# Altium schematic sheet DISPLAYPORT.SchDoc
size A3
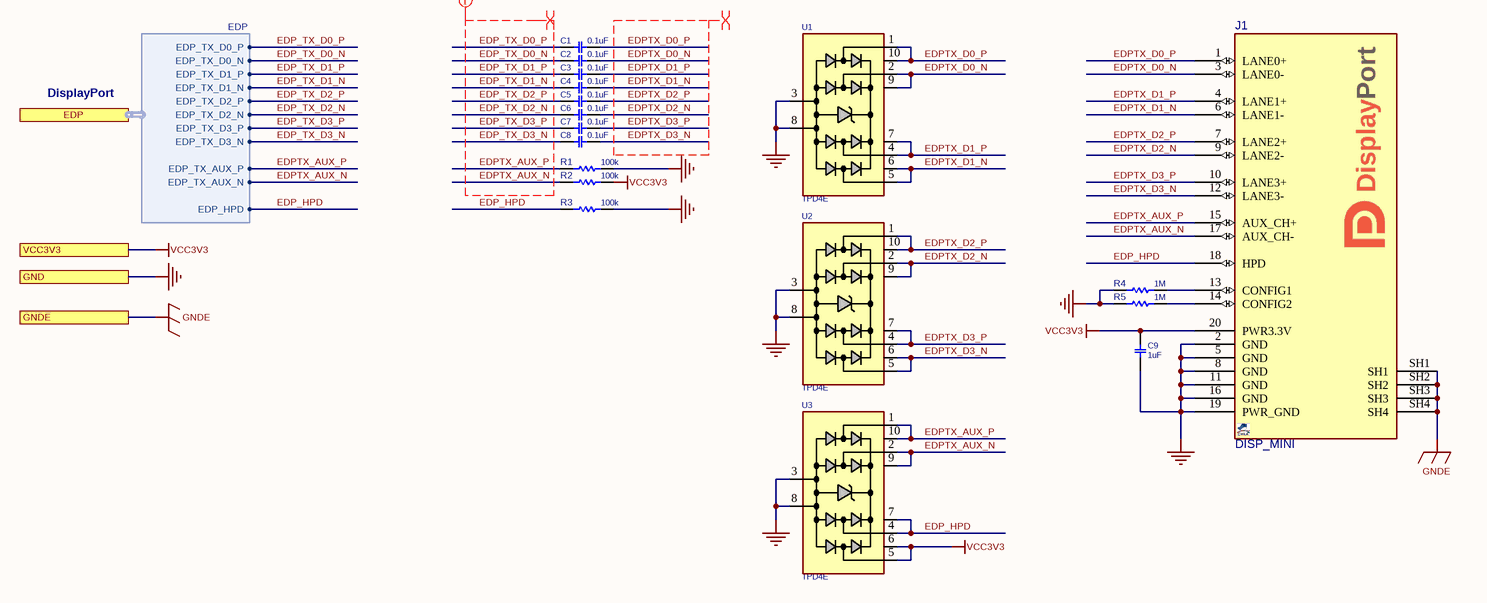
[diagram p0: DISPLAYPORT.SchDoc]

## Parts
C1  0.1uF  [C0402O2]
C2  0.1uF  [C0402O2]
C3  0.1uF  [C0402O2]
C4  0.1uF  [C0402O2]
C5  0.1uF  [C0402O2]
C6  0.1uF  [C0402O2]
C7  0.1uF  [C0402O2]
C8  0.1uF  [C0402O2]
C9  1uF  [C0402]
J1  DISP_MINI  [DISPPORT]
R1  100k  [R0402]
R2  100k  [R0402]
R3  100k  [R0402]
R4  1M  [R0402]
R5  1M  [R0402]
U1  TPD4E  [SON50_10_2510]
U2  TPD4E  [SON50_10_2510]
U3  TPD4E  [SON50_10_2510]

## Ports
EDP (harness EDP), GND, GNDE, VCC3V3

## Harnesses
EDP: EDP_TX_D0_P, EDP_TX_D0_N, EDP_TX_D1_P, EDP_TX_D1_N, EDP_TX_D2_P, EDP_TX_D2_N, EDP_TX_D3_P, EDP_TX_D3_N, EDP_TX_AUX_P, EDP_TX_AUX_N, EDP_HPD

## Nets
GND: C9.2 J1.2(GND) J1.5(GND) J1.8(GND) J1.11(GND) J1.16(GND) J1.19(PWR_GND) R1.1 R3.1 R4.2 R5.2 U1.3 U1.8 U2.3 U2.8 U3.3 U3.8 ; port GND
GNDE: J1.SH1 J1.SH2 J1.SH3 J1.SH4 ; port GNDE
VCC3V3: C9.1 J1.20(PWR3.3V) R2.1 U3.5 U3.6 ; port VCC3V3
EDP_HPD: J1.18(HPD) R3.2 U3.4 U3.7 ; port EDP.EDP_HPD
EDP_TX_D0_N: C2.1 ; port EDP.EDP_TX_D0_N
EDP_TX_D0_P: C1.1 ; port EDP.EDP_TX_D0_P
EDP_TX_D1_N: C4.1 ; port EDP.EDP_TX_D1_N
EDP_TX_D1_P: C3.1 ; port EDP.EDP_TX_D1_P
EDP_TX_D2_N: C6.1 ; port EDP.EDP_TX_D2_N
EDP_TX_D2_P: C5.1 ; port EDP.EDP_TX_D2_P
EDP_TX_D3_N: C8.1 ; port EDP.EDP_TX_D3_N
EDP_TX_D3_P: C7.1 ; port EDP.EDP_TX_D3_P
EDPTX_AUX_N: J1.17(AUX_CH-) R2.2 U3.2 U3.9 ; port EDP.EDP_TX_AUX_N
EDPTX_AUX_P: J1.15(AUX_CH+) R1.2 U3.1 U3.10 ; port EDP.EDP_TX_AUX_P
EDPTX_D0_N: C2.2 J1.3(LANE0-) U1.2 U1.9
EDPTX_D0_P: C1.2 J1.1(LANE0+) U1.1 U1.10
EDPTX_D1_N: C4.2 J1.6(LANE1-) U1.5 U1.6
EDPTX_D1_P: C3.2 J1.4(LANE1+) U1.4 U1.7
EDPTX_D2_N: C6.2 J1.9(LANE2-) U2.2 U2.9
EDPTX_D2_P: C5.2 J1.7(LANE2+) U2.1 U2.10
EDPTX_D3_N: C8.2 J1.12(LANE3-) U2.5 U2.6
EDPTX_D3_P: C7.2 J1.10(LANE3+) U2.4 U2.7
NetJ1_13: J1.13(CONFIG1) R4.1
NetJ1_14: J1.14(CONFIG2) R5.1

## Layout directives
differential pair: EDP_TX_D0_N, EDP_TX_D0_P, EDP_TX_D1_N, EDP_TX_D1_P, EDP_TX_D2_N, EDP_TX_D2_P, EDP_TX_D3_N, EDP_TX_D3_P, EDPTX_AUX_N, EDPTX_AUX_P, EDPTX_D0_N, EDPTX_D0_P, EDPTX_D1_N, EDPTX_D1_P, EDPTX_D2_N, EDPTX_D2_P, EDPTX_D3_N, EDPTX_D3_P
net class EDP: EDP_TX_D0_N, EDP_TX_D0_P, EDP_TX_D1_N, EDP_TX_D1_P, EDP_TX_D2_N, EDP_TX_D2_P, EDP_TX_D3_N, EDP_TX_D3_P, EDPTX_AUX_N, EDPTX_AUX_P

## Notes on the sheet
- DisplayPort

## Library data of the parts
C1-C8 = CAP_SMD_MLCC: CAP, MLCC; PARAM: X5R, 10%; MANF_P#: GRM155R61E104; MANF: Murata; PARAM2: 25v; PRICE: 10,000:	$0.006; ASSEMBLY: ASSEMBLY; VALUE: 0.1uF
C9 = CAP_SMD_MLCC: CAP, MLCC; PARAM: X5R, 10%; MANF_P#: CL05A105KO5NNND; MANF: Samsung; PARAM2: 16v; PRICE: 50,000:	$0.006; ASSEMBLY: ASSEMBLY; VALUE: 1uF
J1 = CONN_DISP: CONN, Display Port, Right-Angle; MANF: Molex, JAE; MANF_P#: 47272-0001, 47272-0024, DP1RD20JQ1R400, DP1RD20JQ2R400; PARAM: Display Port, MINI, Right-Angle; MANF_P#2: 105019-0001, 0472720024, DP1R020JQ3; PRICE: 5.7$; VALUE: DISP_MINI
R1-R5 = RES_SMD: RESISTOR, SMD; PARAM: 0.063W; DESC: DESCRIPTION; DIST#: MOUSER; PARAM2: 1%; MANF_P#: -; MANF: -; ASSEMBLY: ASSEMBLY; PRICE: 100= 0.3$
  R1-R3: VALUE: 100k
  R4 R5: VALUE: 1M
U1-U3 = TVS_X4_TPD4E05U06: TVS, ESD PROTECT, 4CH,; MANF_P#: TPD4E05U06DQA; MANF: Texas Instruments; PARAM2: 6.5Vbr, 0.4pF, –40°~125°C; PARAM: ±12-kV ContactD, ±15-kVAirD; PRICE: 0.6$; VALUE: TPD4E